# EAGLE design metal detector proto1 (EAGLE 7.5.0)
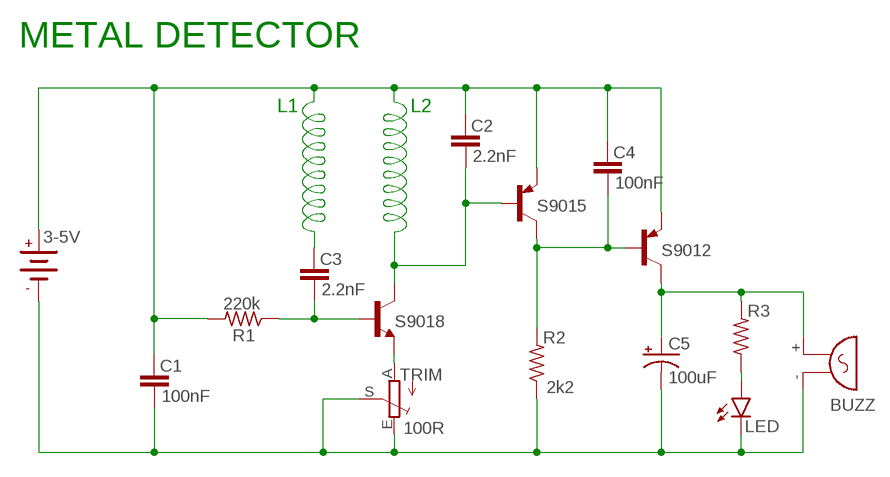
[diagram p0: schematic, sheet 1]

## Parts
3-5V  3-5V  DC_BATT  [AB9V]
BUZZ  F/QMX  [F/QMX]
C1  100nF  CER/FILMBOX.1  [BOX_SMALL]
C2  2.2nF  CER/FILMBOX.1  [BOX_SMALL]
C3  2.2nF  CER/FILMBOX.1  [BOX_SMALL]
C4  100nF  CER/FILMBOX.1  [BOX_SMALL]
C5  100uF  0631  [063_025]
LED  LED5MM  [LED5MM]
R1  220k  R_.3B  [R0207/3]
R2  2k2  R_.3B  [R0207/3]
R3  R_.3B  [R0207/3]
S9012  S9012  [TO92-EBC]
S9015  S9015  [TO92-EBC]
S9018  S9018  [TO92-EBC]
TRIM  100R  TRIM_EU-RJ9W  [RJ9W]

## Nets
GND: 3-5V.- BUZZ.- C1.2 C5.- LED.K(C) R2.1 TRIM.E TRIM.S
N$3: C4.2 R2.2 S9012.2(B) S9015.3(C)
N$4: BUZZ.+ C5.+ R3.2 S9012.3(C)
N$5: LED.A R3.1
N$7: 3-5V.+ C1.1 C2.1 C2.2 C3.1 C4.1 R1.2 S9012.1(E) S9015.1(E) S9015.2(B) S9018.3(C)
N$15: S9018.1(E) TRIM.A
N$16: C3.2 R1.1 S9018.2(B)

## Notes on the sheet
- METAL DETECTOR
- L1 | L2

## Library data of the parts
3-5V = supply pins:DC_BATT
BUZZ = buzzer:F/QMX: BUZZER Source: Buerklin; OC_FARNELL: unknown; OC_NEWARK: unknown
C1-C4 = capacitors-film:CER/FILM: 47 - 120pF Xicon Ceramic Disc 2.5mm lead spacing
C5 = capacitors-elec:063: 33 - 220uF Xicon values at Mouser.com 10V: 220uF; 16V: 100uF; 25V: 100uF; 50V: 33uF
LED = diodes_mod:LED
R1-R3 = resistors:R_
S9012 = transistors:S9012
S9015 = transistors:S9015
S9018 = transistors:S9018
TRIM = pot:TRIM_EU-: POTENTIOMETER

## Board
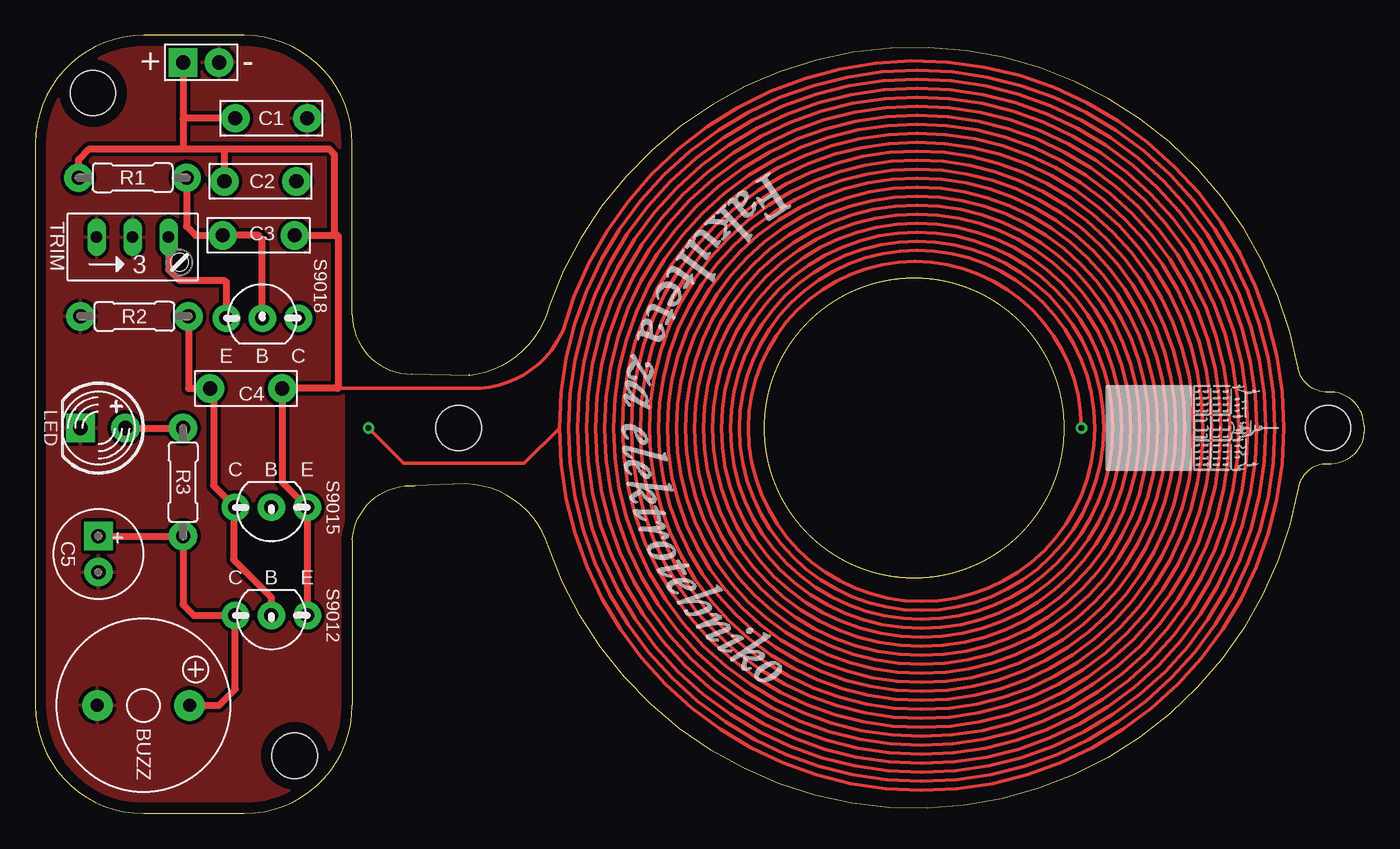
[diagram p1: board, top side]
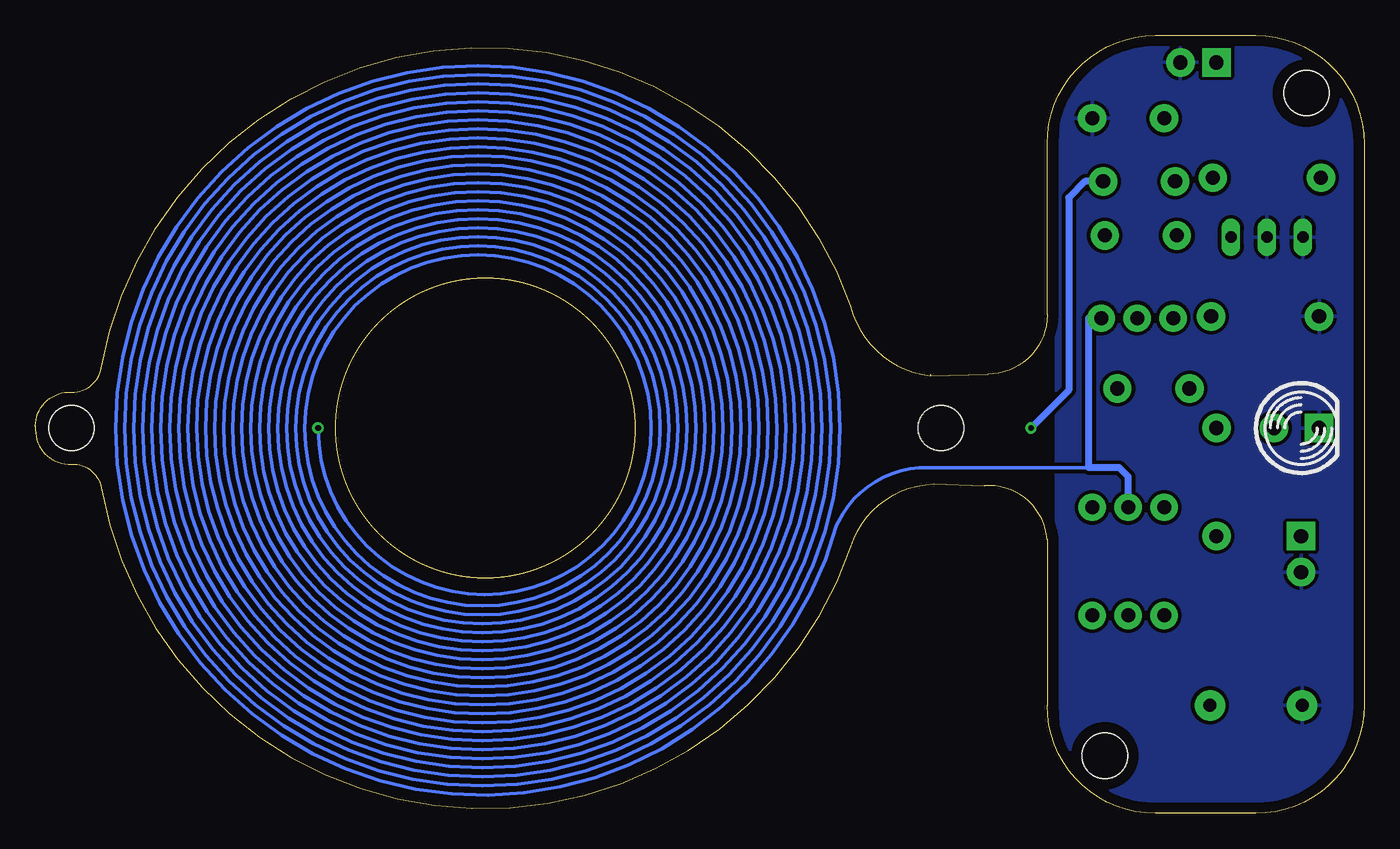
[diagram p2: board, bottom side, seen from below]

Size 93.73 x 54.86 mm. Coordinates in mm from the lower left corner, seen from the top.
Outline: 30.61,30.99 30.61,30.86
Outline: 30.61,30.86 26.54,30.99 arc-90 22.35,35.18 22.35,47.24 arc90 14.73,54.86 7.62,54.86 arc90 0,47.24 0,7.62 arc90 7.62,0 14.73,0 arc90 22.35,7.62 22.35,19.3 arc-90 26.8,23.11 30.35,23.24 arc-71 36.2,18.8 arc151 89.08,22.96 arc-83 91.19,24.64 arc93 93.73,27.05 93.73,27.3 arc93 91.19,29.72 arc-83 89.08,31.39 arc150 36.22,35.76 arc-69 30.61,30.86
Outline: circle at 61.98,27.18 radius 10.57
Copper layers (1*16): Top 0.035mm / dielectric 1.5mm / Bottom 0.035mm
Design rules "default *": minimum track width 10mil, minimum drill 15mil, track to track 10mil, track to pad 10mil, pad to pad 10mil, via to via 8mil, smd to smd 8mil, copper to edge 30mil, drill to drill 8mil, minimum pad ring 10mil, minimum via ring 8mil, stop-mask expansion 4mil, vias tented up to drill 17mil, thermal gap 10mil
Holes 3.2 mm at 4.06,50.8 18.29,4.06 29.84,27.18 91.19,27.18

### Footprints (pad centres in the part's own frame; a part is rotated, then mirrored left to right if it is on the bottom)
AB9V = drill 1 pad 2 square: + 0,1.27 | drill 1 pad 2: - 0,-1.27
F/QMX = drill 0.914 pad 2.159: + 3.251,0; - -3.251,0
BOX_SMALL = drill 1 pad 2: 1 -2.54,0; 2 2.54,0
063_025 = drill 1 pad 2 square: + -1.27,0 | drill 1 pad 2: - 1.27,0
LED5MM = drill 1 pad 2: A -1.905,0 | drill 1 pad 2 square: K 1.27,0
R0207/3 = drill 1 pad 2: 1 -3.81,0; 2 3.81,0
TO92-EBC = drill 1 pad 1.93: 1 -2.54,0; 2 0,0; 3 2.54,0
RJ9W = drill 0.813 long: A 2.54,0.635; E -2.54,0.635; S 0,0.635

### Placement (x,y rotation side)
3-5V  11.68,52.96 90 top
BUZZ  7.62,7.62 0 top
C1  16.64,49.02 0 top
C2  15.88,44.58 180 top
C3  15.75,40.77 180 top
C4  14.86,29.97 180 top
C5  4.45,18.29 270 top
LED  4.45,27.18 180 top
R1  6.86,44.83 180 top
R2  6.99,35.05 0 top
R3  10.41,23.37 270 top
S9012  16.64,13.97 180 top
S9015  16.64,21.59 180 top
S9018  16,34.92 0 top
TRIM  6.86,40.01 0 top

### Tracks (layer width: path | path; a pad name or v marks a point on that pad's centre or on a via)
GND
  pour Top: 0.25,54.61 21.72,54.61 21.72,0.25 0.25,0.25
  pour Bottom: 21.72,54.74 -0.25,54.74 -0.25,0.25 21.72,0.25
N$3
  Top 0.508: S9012.2 16.64,15.24 13.97,17.91 13.97,21.46 S9015.3 12.57,23.11 12.57,29.72 C4.2 10.79,29.97 R2.2
N$4
  Top 0.508: BUZZ.+ 12.95,7.62 14.1,8.76 S9012.3 11.18,13.97 10.41,14.73 R3.2 C5.+
N$5
  Top 0.508: LED.A R3.1
N$7  (via drill 0.38, 0.41)
  Top 0.254: 21.34,29.97 30.73,29.97 arc65 37.08,33.78 37.21,34.04 arc-165 88.07,27.18 arc-180 36.96,27.18 | 36.96,27.18 arc-180 87.44,27.18 arc-180 37.59,27.18 arc-180 86.8,27.18 arc-180 38.23,27.18 arc-180 86.17,27.18 arc-180 38.86,27.18 arc-180 85.53,27.18 arc-180 39.5,27.18 arc-180 84.9,27.18 arc-180 40.13,27.18 arc-180 84.26,27.18 arc-180 40.77,27.18 arc-180 83.63,27.18 arc-180 41.4,27.18 arc-180 83,27.18 arc-180 42.04,27.18 arc-180 82.36,27.18 arc-180 42.67,27.18 arc-180 81.72,27.18 arc-180 43.31,27.18 arc-180 81.09,27.18 arc-180 43.94,27.18 arc-180 80.45,27.18 arc-180 44.58,27.18 arc-180 79.82,27.18 arc-180 45.21,27.18 arc-180 79.18,27.18 arc-180 45.85,27.18 arc-180 78.55,27.18 arc-180 46.48,27.18 arc-180 77.92,27.18 arc-180 47.12,27.18 arc-180 77.28,27.18 arc-180 47.75,27.18 arc-180 76.64,27.18 arc-180 48.39,27.18 arc-180 76.01,27.18 arc-180 49.02,27.18 arc-180 75.37,27.18 arc-180 49.66,27.18 arc-180 74.74,27.18 arc-180 50.29,27.18 arc-180 v73.79,27.18 | v23.5,27.18 25.98,24.69 34.47,24.69 36.96,27.18
  Top 0.508: 21.08,40.77 21.08,46.48 20.7,46.86 13.34,46.86 | C3.1 21.08,40.77 | 21.08,40.77 21.34,40.77 21.34,29.97 C4.1 17.4,23.37 S9015.1 S9012.1 | R1.2 3.05,46.1 3.81,46.86 10.41,46.86 | 10.41,46.86 13.34,46.86 | 3-5V.+ 10.41,49.02 | 10.41,49.02 10.41,46.86 | C2.2 13.34,46.86 | C1.1 10.41,49.02
  Bottom 0.254: 19.43,24.38 30.73,24.38 arc-65 37.08,20.57 37.21,20.32 arc165 88.07,27.18 arc180 36.96,27.18 arc180 87.44,27.18 arc180 37.59,27.18 arc180 86.8,27.18 arc180 38.23,27.18 arc180 86.17,27.18 arc180 38.86,27.18 arc180 85.53,27.18 arc180 39.5,27.18 arc180 84.9,27.18 arc180 40.13,27.18 arc180 84.26,27.18 arc180 40.77,27.18 arc180 83.63,27.18 arc180 41.4,27.18 arc180 83,27.18 arc180 42.04,27.18 arc180 82.36,27.18 arc180 42.67,27.18 arc180 81.72,27.18 arc180 43.31,27.18 arc180 81.09,27.18 arc180 43.94,27.18 arc180 80.45,27.18 arc180 44.58,27.18 arc180 79.82,27.18 arc180 45.21,27.18 arc180 79.18,27.18 arc180 45.85,27.18 arc180 78.55,27.18 arc180 46.48,27.18 arc180 77.92,27.18 arc180 47.12,27.18 arc180 77.28,27.18 arc180 47.75,27.18 arc180 76.64,27.18 arc180 48.39,27.18 arc180 76.01,27.18 arc180 49.02,27.18 arc180 75.37,27.18 arc180 49.66,27.18 arc180 74.74,27.18 arc180 50.29,27.18 arc180 v73.79,27.18 | 19.68,44.58 19.81,44.58
  Bottom 0.508: S9015.2 16.64,23.75 17.27,24.38 19.43,24.38 19.43,34.92 S9018.3 | C2.1 19.68,44.58 20.83,43.43 20.83,29.84 v23.5,27.18
N$15
  Top 0.254: 13.34,37.59 13.46,37.47
  Top 0.508: TRIM.A 9.4,38.35 10.16,37.59 13.34,37.59 | 13.46,37.47 S9018.1
N$16
  Top 0.254: 16,40.51 15.75,40.77
  Top 0.508: S9018.2 16,40.51 | 15.75,40.77 C3.2 11.3,40.77 10.67,41.4 R1.1

### Text on the board
tPlace: + | -